# Altium schematic sheet Hi_Current.SchDoc: MoonPilot - Hi Current Out
size A3; DrawnBy: Máni Magnússon; Revision: A; SheetNumber: 7
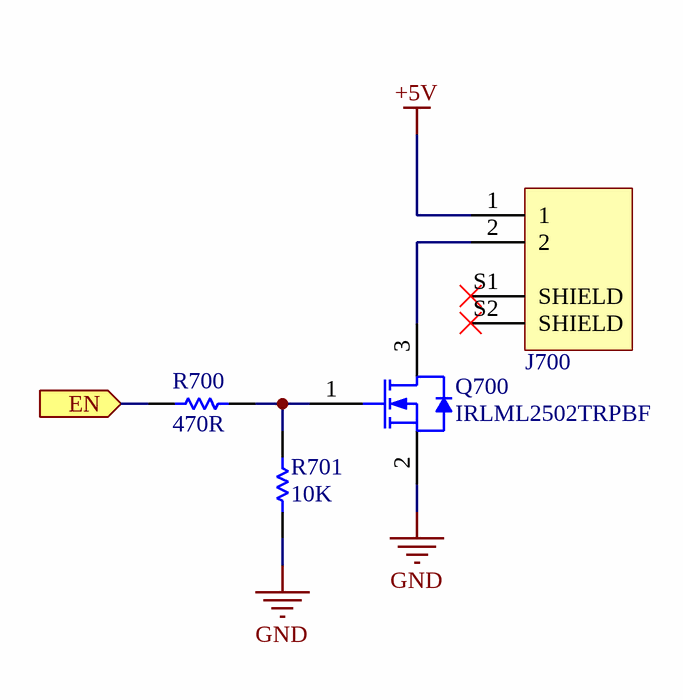
[diagram p0: Hi_Current.SchDoc]

## Parts
J700  2 pin vertical JST GH  [JST_BM02B-GHS-TBT(LF)(SN)(N)]  (value not drawn)
Q700  IRLML2502TRPBF  [INTR-SOT-23-3_V]
R700  470R  [0603_RES]
R701  10K  [0603_RES]

## Ports
EN (in)

## Nets
+5V: J700.1
GND: Q700.2(S) R701.2
EN: R700.1 ; port EN
NetJ700_2: J700.2 Q700.3(D)
NetQ700_1: Q700.1(G) R700.2 R701.1

Not connected (* = marked no-connect by the designer): J700 S1(SHIELD)* S2(SHIELD)*

## Notes on the sheet
- Sheet title:
- Revision:
- Drawn by:
- Date:
- File:

## Library data of the parts
J700 = BM02B-GHS-TBT(LF)(SN)(N): JST GH vertical 2 pin / DigiKey part no. 455-1578-1-ND; MF: JST Sales; MP: BM04B-GHS-TBT_LF__SN__N_; SnapEDA_Link: https://www.snapeda.com/parts/BM04B-GHS-TBT%28LF%29%28SN%29%28N%29/JST%20Sales%20America%20Inc./view-part/841999/?ref=snap; Digi-Key_Part_Number: 455-1580-1-ND; Digi-Key_Purchase_URL: https://www.digikey.com/product-detail/en/jst-sales-america-inc/BM04B-GHS-TBT_LF__SN__N_/455-1580-1-ND/807848?utm_source=snapeda&utm_medium=aggregator&utm_campaign=symbol; Value: *; Package: None
Q700 = IRLML2502TRPBF: N-Channel HEXFET(R) Power MOSFET, 20 V VDS, +/- 12 V VGS, 4.2 A, 3-Pin SOT23, RoHS, Tape and Reel; Manufacturer: International Rectifier; Drain-to-Source Voltage [Vdss]: 20V; Drain-Source On Resistance-Max: 0.045O; Qg Gate Charge: 8nC; Rated Power Dissipation: 1.25W; Package Reference: SOT-23-3; Manufacturer URL: http://internationalrectifier.com/; Package Description: 3-Pin Small Outline Transistor, Body 2.92 x 1.3 mm, Pitch 0.95 mm; Datasheet Version: Apr-14; Channel Type: N-Channel; Datasheet URL: https://datasheet.ciiva.com/6383/irlml2502pbf-6383216.pdf
R700 R701 = Resistor